# EAGLE design 222_environment (EAGLE 9.6.2)
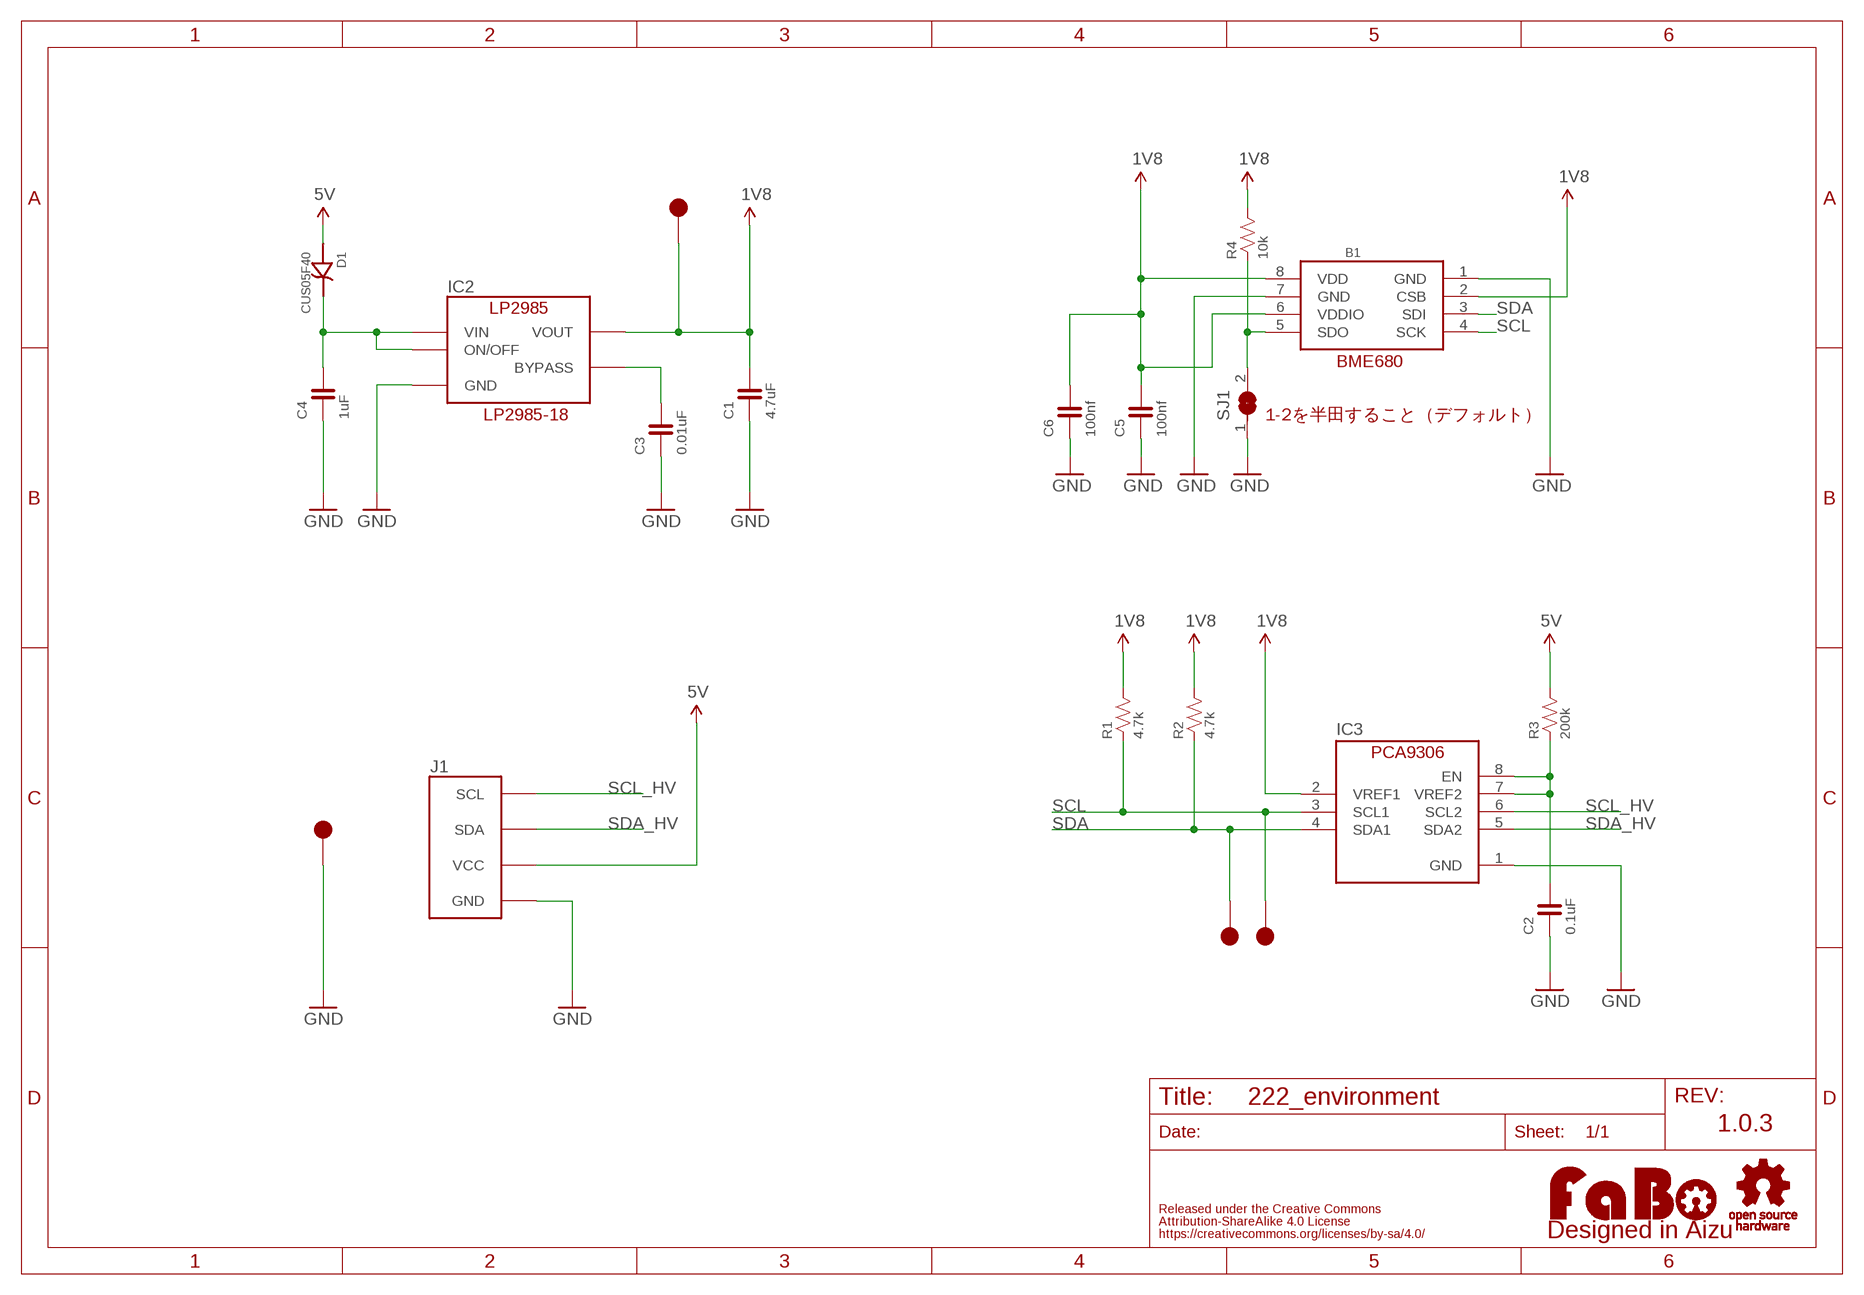
[diagram p0: schematic, sheet 1]

## Parts
B1  BO-BME680  [BOSCH-BME680]
C1  4.7uF  CAPACITOR-0603  [0603]
C2  0.1uF  CAPACITOR-0603  [0603]
C3  0.01uF  CAPACITOR-0603  [0603]
C4  1uF  CAPACITOR-0603  [0603]
C5  100nf  CAPACITOR-0603  [0603]
C6  100nf  CAPACITOR-0603  [0603]
D1  CUS05F40  [CUS05F40]
IC2  LP2985-33DBV  [SOT-23-5]
IC3  PCA9306_SSOP  [8PIN-SSOP]
J1  FABO_BRICK_I2C  [FABO_BRICK_I2C]
LOGO1  LOGO_FABO-M  [LOGO_FABO_M]
R1  4.7k  RESISTOR-0603  [0603]
R2  4.7k  RESISTOR-0603  [0603]
R3  200k  RESISTOR-0603  [0603]
R4  10k  RESISTOR-0603  [0603]
SJ1  SJ  [SJ]
TP1  TP-15  [TP-15]
TP2  TP-15  [TP-15]
TP3  TP-15  [TP-15]
TP4  TP-15  [TP-15]
U$2  LOGO_OSHW-M_BOTTOM  [LOGO_OSHW_M_BOTTOM]

## Nets
1V8: B1.2(CSB) B1.6(VDDIO) B1.8(VDD) C1.2 C5.2 C6.2 IC2.5(VOUT) IC3.2(VREF1) R1.2 R2.2 R4.2 TP3.1
5V: D1.A(ANODE) J1.VCC R3.2
GND: B1.1(GND) B1.7(GND) C1.1 C2.1 C3.1 C4.1 C5.1 C6.1 IC2.2(GND) IC3.1(GND) J1.GND SJ1.1 TP4.1
N$1: C2.2 IC3.7(VREF2) IC3.8(EN) R3.1
N$2: B1.5(SDO) R4.1 SJ1.2
N$3: C3.2 IC2.4(BYPASS)
N$4: C4.2 D1.C(CATHODE) IC2.1(VIN) IC2.3(ON/OFF)
SCL: B1.4(SCK) IC3.3(SCL1) R1.1 TP2.1
SCL_HV: IC3.6(SCL2) J1.SCL
SDA: B1.3(SDI) IC3.4(SDA1) R2.1 TP1.1
SDA_HV: IC3.5(SDA2) J1.SDA

## Notes on the sheet
- BME680
- LP2985-18 | 1-2を半田すること（デフォルト）
- 1.0.3

## Library data of the parts
B1 = FaBo-Mems:BO-BME680
C1-C6 = FaBo-Capacitor:CAPACITOR: CAPACITOR
D1 = FaBo-Diode:CUS05F40
IC2 = FaBo-Supply:LP2985: LP2985
IC3 = FaBo-LevelTranslator:PCA9306
J1 = FaBo-Template:FABO_BRICK_I2C: FaBo Brick I2C
LOGO1 = component:LOGO_FABO
R1-R4 = FaBo-Resistors:RESISTOR: RESISTOR
SJ1 = jumper:SJ: SMD solder JUMPER
TP1-TP4 = FaBo-Supply:TP
U$2 = FaBo-etc:LOGO_OSHW

## Board
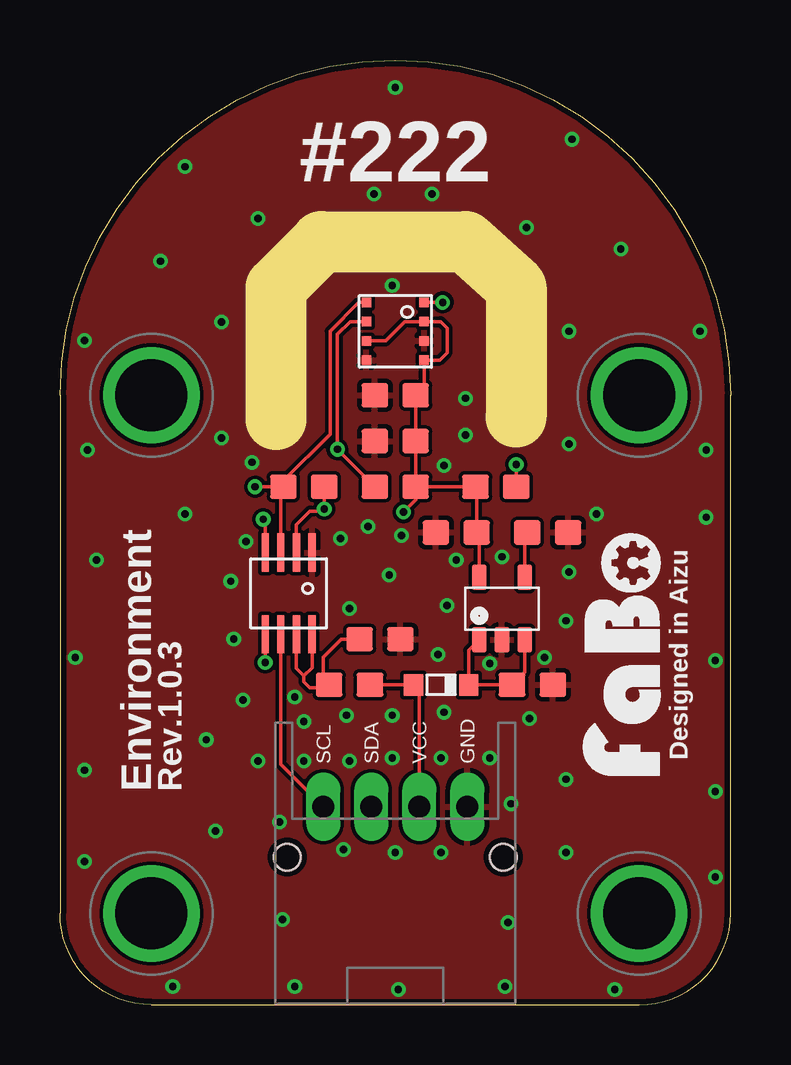
[diagram p1: board, top side]
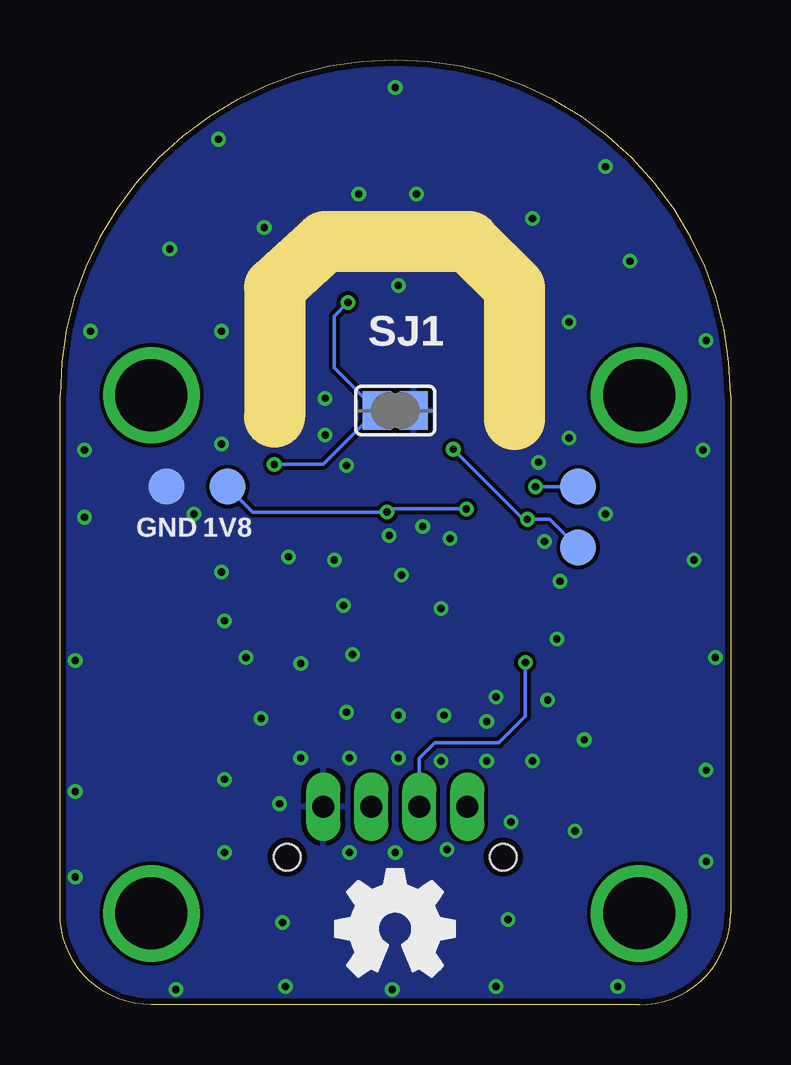
[diagram p2: board, bottom side, seen from below]

Size 27.94 x 39.37 mm. Coordinates in mm from the lower left corner, seen from the top.
Copper layers (1*16): Top 0.035mm / dielectric 1.6mm / Bottom 0.035mm
Design rules "PCBway": minimum track width 6mil, minimum drill 12mil, track to track 6mil, track to pad 6mil, pad to pad 6mil, via to via 6mil, smd to smd 6mil, copper to edge 10mil, drill to drill 10mil, minimum pad ring 10mil, minimum via ring 6mil, stop-mask expansion 2mil, vias tented up to drill 100mil, thermal gap 8mil
Milling: 5 lines

### Footprints (pad centres in the part's own frame; a part is rotated, then mirrored left to right if it is on the bottom)
BOSCH-BME680 = smd 0.4 x 0.4: 1 -1.2,1.2; 2 -0.4,1.2; 3 0.4,1.2; 4 1.2,1.2; 5 1.2,-1.2; 6 0.4,-1.2; 7 -0.4,-1.2; 8 -1.2,-1.2
0603 = smd 1.1 x 1: 1 -0.85,0; 2 0.85,0
CUS05F40 = smd 0.8 x 0.9: A -1.15,0; C 1.15,0
SOT-23-5 = smd 0.6 x 1.05: 1 -0.95,-1.3; 2 0,-1.3; 3 0.95,-1.3; 4 0.95,1.3; 5 -0.95,1.3
8PIN-SSOP = smd 0.3 x 1.6: 1 -0.975,-1.7; 2 -0.325,-1.7; 3 0.325,-1.7; 4 0.975,-1.7; 5 0.975,1.7; 6 0.325,1.7; 7 -0.325,1.7; 8 -0.975,1.7
FABO_BRICK_I2C = drill 0.9 pad 1.422 long: GND 3,-10.795; SCL -3,-10.795; SDA -1,-10.795; VCC 1,-10.795 | drill 3 pad 3.81: P$1 -10.16,6.35; P$2 10.16,6.35; P$3 -10.16,-15.24; P$4 10.16,-15.24 | hole 1.1: -4.5,-12.895; 4.5,-12.895
SJ = smd 1.168 x 1.6: 1 -0.762,0; 2 0.762,0
TP-15 = smd 1.5 x 1.5: 1 0,0

### Placement (x,y rotation side)
B1  13.97,28.07 90 top
C1  16.51,19.68 0 top
C2  13.34,15.24 180 top
C3  20.32,19.68 180 top
C4  19.68,13.34 180 top
C5  13.97,25.4 0 top
C6  13.97,23.5 0 top
D1  15.88,13.34 0 top
IC2  18.41,16.51 0 top
IC3  9.53,17.14 180 top
J1  13.97,19.05 0 top
LOGO1  25.4,14.61 90 top
R1  10.16,21.59 0 top
R2  13.97,21.59 0 top
R3  12.06,13.34 0 top
R4  18.16,21.59 180 top
SJ1  13.97,24.77 180 bottom
TP1  6.35,19.05 0 bottom
TP2  6.35,21.59 0 bottom
TP3  20.95,21.59 0 bottom
TP4  23.5,21.59 0 bottom
U$2  13.97,3.17 0 top

### Tracks (layer width: path | path; a pad name or v marks a point on that pad's centre or on a via)
1V8  (via drill 0.3)
  Top 0.152: IC2.5 17.46,19.58 C1.2 17.36,21.54 R4.2 R2.2 | R2.2 C6.2 C5.2 15.17,25.75 B1.8 15.82,26.87 16.13,27.18 16.13,28.19 15.86,28.47 B1.6 14.37,28.47 13.57,27.67 B1.2 | IC3.2 9.85,20.01 10.41,20.57 10.92,20.57 v11.01,20.66 R1.2 | R2.2 14.82,21.04 v14.31,20.54
  Bottom 0.152: v11.01,20.66 14.19,20.66 v14.31,20.54 19.9,20.54 TP3.1
5V
  Top 0.152: J1.VCC 14.97,13.09 D1.A R3.2
GND  (via drill 0.3)
  other vias: 17.91,14.22 20.19,14.48 19.56,11.94 16,12.19 15.88,10.29 13.84,10.29 12.06,10.16 10.16,10.16 8.26,10.16 10.16,11.81 9.78,12.83 11.94,12.06 13.84,12.06 17.91,10.29 18.8,8.38 21.08,9.4 21.08,16 21.21,18.03 18.41,18.67 16.51,18.54 16.13,16.64 15.75,14.61 12.06,16.51 11.68,19.43 13.72,17.91 7.11,17.65 7.75,19.3 7.24,15.24 7.62,12.7 9.14,7.62 11.81,6.48 13.97,6.35 15.88,6.35 14.1,0.64 9.78,0.76 18.54,0.76 23.11,0.64 27.3,5.33 1.02,5.97 4.7,0.76 27.3,14.35 27.3,8.89 26.92,20.32 22.35,20.45 26.92,23.11 21.21,23.37 16,22.48 16.89,23.75 16.89,25.27 14.22,19.56 12.83,19.94 5.21,20.45 8,22.61 13.84,29.97 21.21,28.07 26.67,28.07 6.73,28.45 6.73,23.62 1.14,23.11 1.02,27.69 0.64,14.48 1.02,9.78 1.52,18.54 6.48,7.24 21.08,6.35 9.27,3.56 18.67,3.43 13.97,38.23 21.34,36.07 5.21,34.92 8.26,32.77 19.43,32.38 23.37,31.5 4.19,30.99 13.08,33.78 15.49,33.78 6.1,11.05
  pour Bottom (isolate 0.152): 0,0 27.94,0 27.94,39.37 0,39.37
  pour Top (isolate 0.152): 0,0 27.94,0 27.94,39.37 0,39.37
N$1
  Top 0.152: IC3.7 9.85,14.03 10.16,13.72 | C2.2 11.72,15.24 10.96,14.48 10.96,13.59 R3.1 11.09,13.21 10.41,13.21 10.16,13.46 10.16,13.72 | IC3.8 10.5,14.06 10.16,13.72
N$2  (via drill 0.3)
  Top 0.152: B1.5 v15.95,29.27 | R4.1 v19.01,22.52
  Bottom 0.152: v15.95,29.27 16.51,28.7 16.51,26.54 SJ1.2 16.98,22.52 v19.01,22.52
N$3
  Top 0.152: IC2.4 19.36,19.58 C3.2
N$4
  Top 0.152: IC2.3 19.36,13.87 C4.2 D1.C 17.02,14.77 IC2.1
SCL  (via drill 0.3)
  Top 0.152: B1.4 12.45,29.27 11.25,28.07 11.25,23.79 9.31,21.84 R1.1 | IC3.3 9.2,21.48 R1.1 | R1.1 v8.13,21.59
  Bottom 0.152: v8.13,21.59 TP2.1
SCL_HV
  Top 0.152: IC3.6 9.2,10.03 J1.SCL
SDA  (via drill 0.3)
  Top 0.152: B1.3 12.08,28.47 11.56,27.94 v11.56,23.15 R2.1 | IC3.4 8.55,20.15 v8.47,20.23
  Bottom 0.152: v11.56,23.15 8.64,20.23 v8.47,20.23 7.53,20.23 TP1.1
SDA_HV  (via drill 0.3)
  Top 0.152: IC3.5 v8.55,14.27
  Bottom 0.152: v8.55,14.27 8.55,12.02 9.65,10.92 12.32,10.92 12.97,10.27 J1.SDA

### Text on the board
tPlace: #222 | Designed in Aizu | Environment | Rev.1.0.3
bPlace: 1V8 | GND